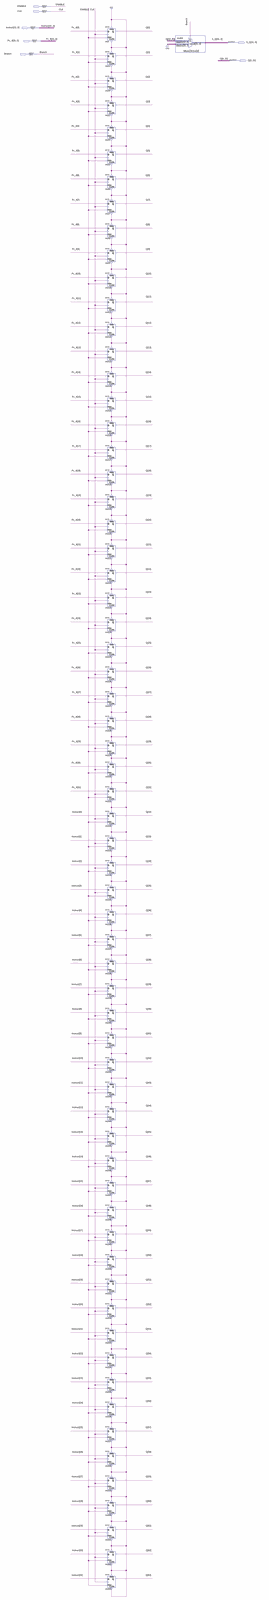
[diagram p0: schematic sheet, whole]
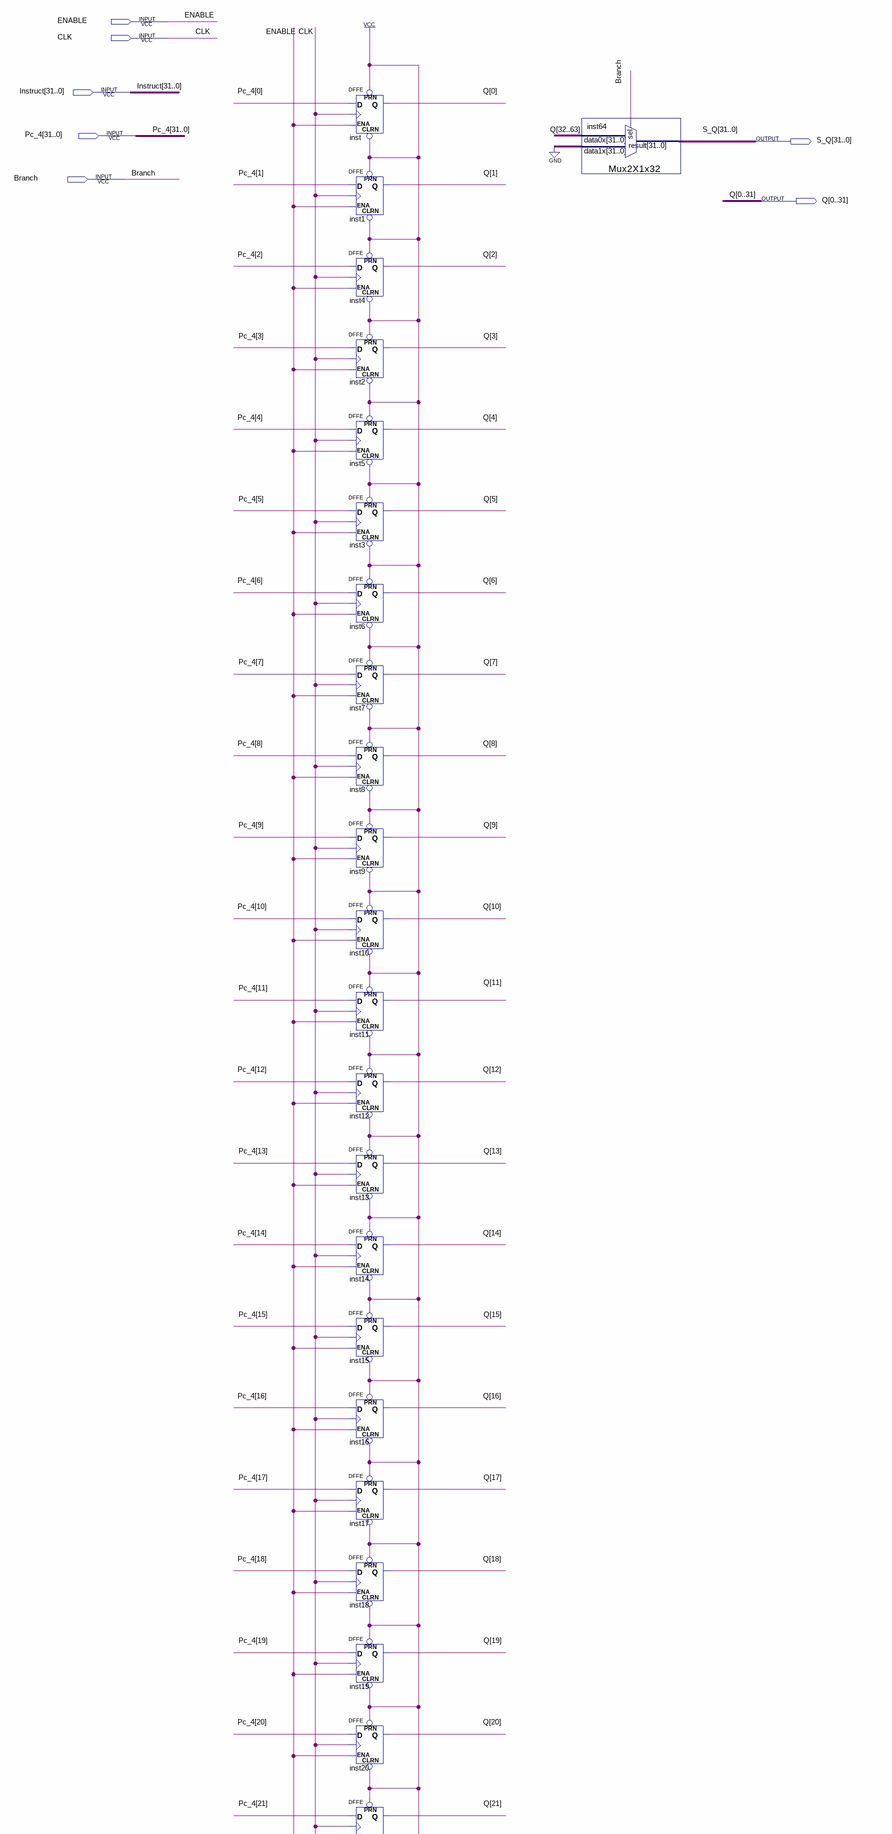
[diagram p1: schematic sheet, upper part]
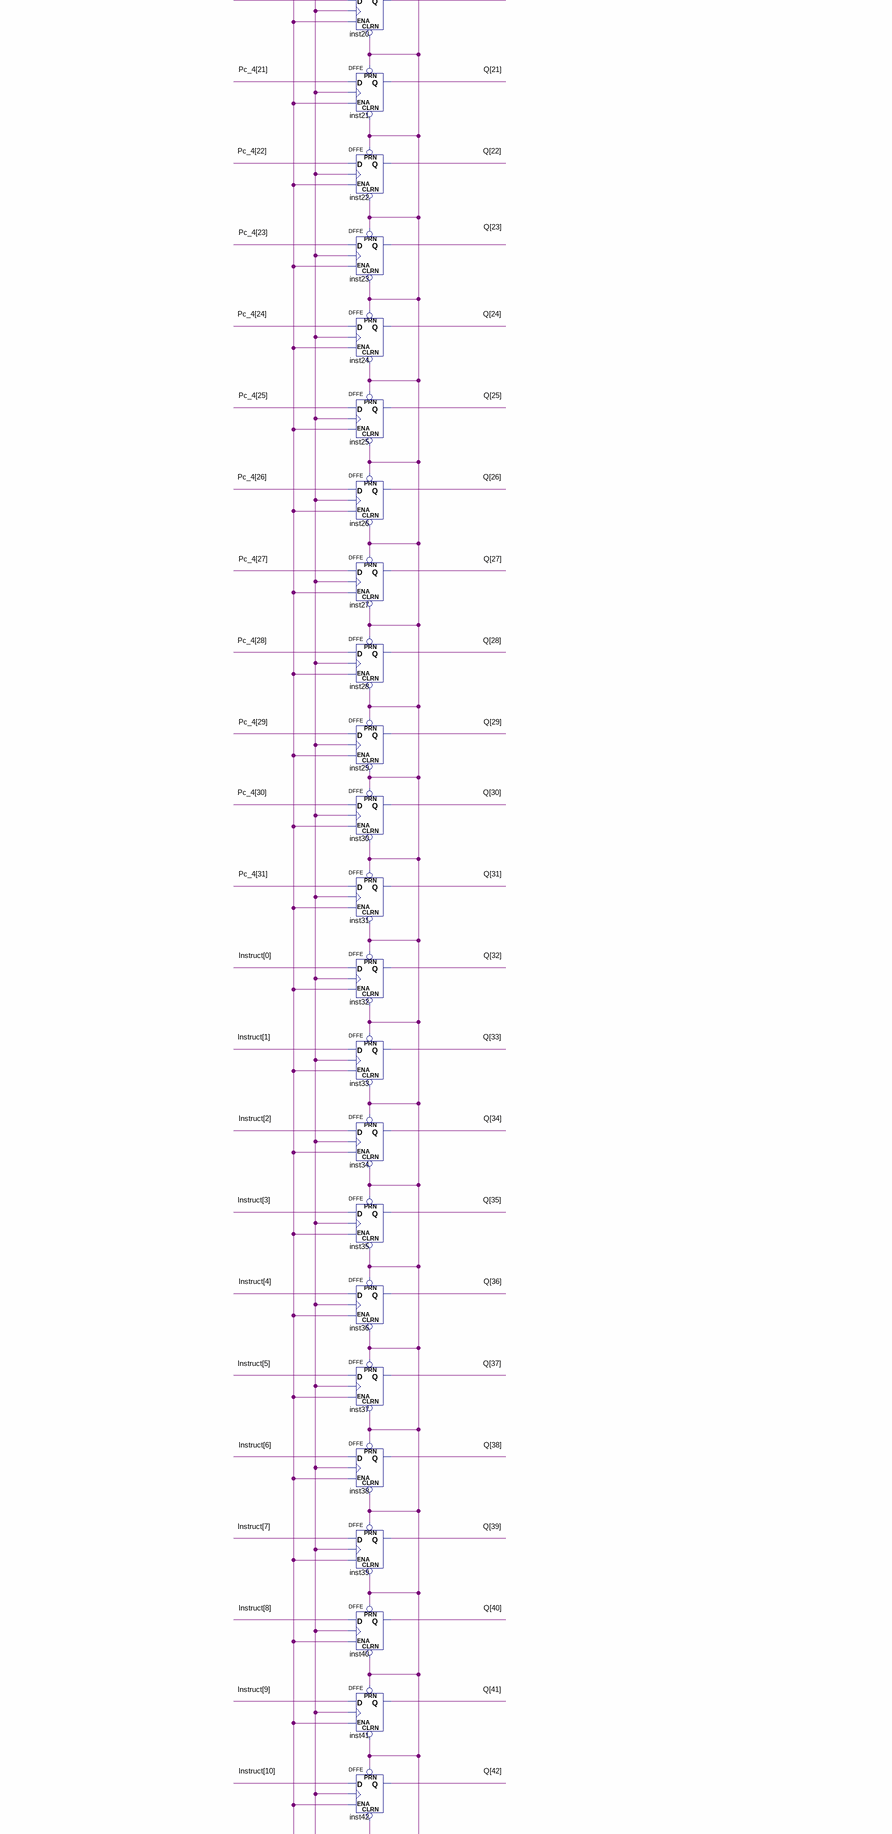
[diagram p2: schematic sheet, middle part]
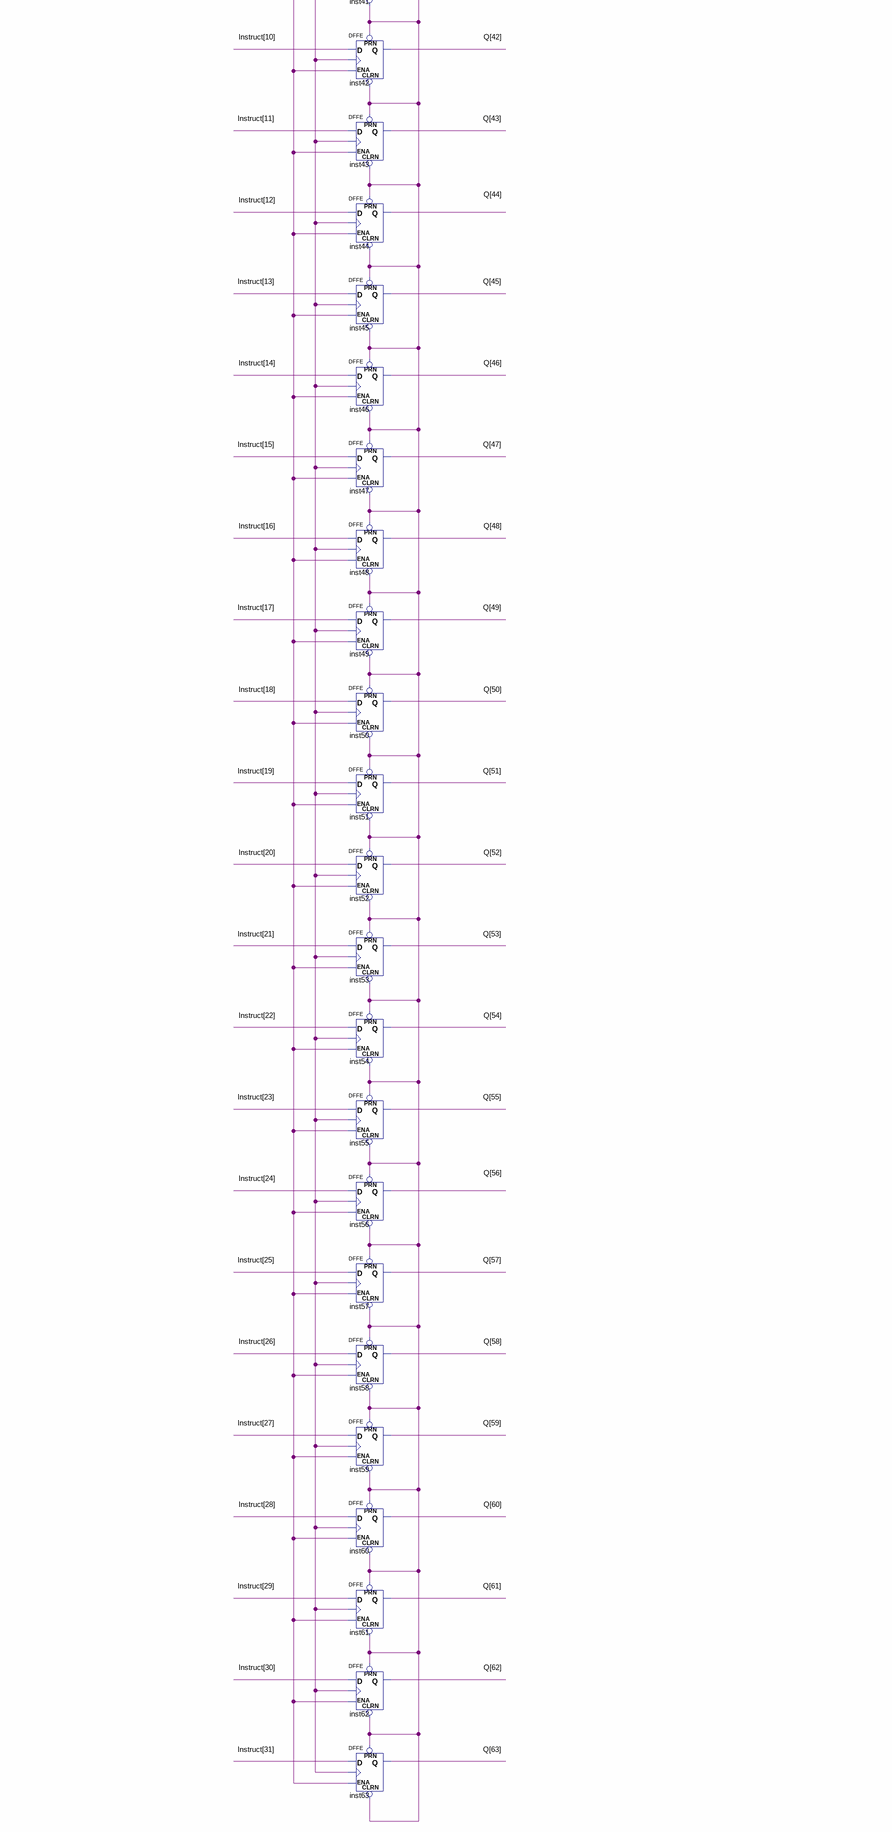
[diagram p3: schematic sheet, lower part]
// Quartus schematic Reg64_Bits.bdf as structural Verilog: 65 symbols, 7 pins
module Reg64_Bits (
  input  ENABLE,
  input  CLK,
  input  [31:0] Instruct,
  input  [31:0] Pc_4,
  input  Branch,
  output [31:0] S_Q,
  output [0:63] Q
);

  DFFE inst (.PRN(1'b1), .CLRN(1'b1), .D(Pc_4[0]), .CLK(CLK), .ENA(ENABLE), .Q(Q[0]));
  DFFE inst1 (.PRN(1'b1), .CLRN(1'b1), .D(Pc_4[1]), .CLK(CLK), .ENA(ENABLE), .Q(Q[1]));
  DFFE inst4 (.PRN(1'b1), .CLRN(1'b1), .D(Pc_4[2]), .CLK(CLK), .ENA(ENABLE), .Q(Q[2]));
  DFFE inst2 (.PRN(1'b1), .CLRN(1'b1), .D(Pc_4[3]), .CLK(CLK), .ENA(ENABLE), .Q(Q[3]));
  DFFE inst5 (.PRN(1'b1), .CLRN(1'b1), .D(Pc_4[4]), .CLK(CLK), .ENA(ENABLE), .Q(Q[4]));
  DFFE inst3 (.PRN(1'b1), .CLRN(1'b1), .D(Pc_4[5]), .CLK(CLK), .ENA(ENABLE), .Q(Q[5]));
  DFFE inst6 (.PRN(1'b1), .CLRN(1'b1), .D(Pc_4[6]), .CLK(CLK), .ENA(ENABLE), .Q(Q[6]));
  DFFE inst7 (.PRN(1'b1), .CLRN(1'b1), .D(Pc_4[7]), .CLK(CLK), .ENA(ENABLE), .Q(Q[7]));
  DFFE inst8 (.PRN(1'b1), .CLRN(1'b1), .D(Pc_4[8]), .CLK(CLK), .ENA(ENABLE), .Q(Q[8]));
  DFFE inst9 (.PRN(1'b1), .CLRN(1'b1), .D(Pc_4[9]), .CLK(CLK), .ENA(ENABLE), .Q(Q[9]));
  DFFE inst10 (.PRN(1'b1), .CLRN(1'b1), .D(Pc_4[10]), .CLK(CLK), .ENA(ENABLE), .Q(Q[10]));
  DFFE inst11 (.PRN(1'b1), .CLRN(1'b1), .D(Pc_4[11]), .CLK(CLK), .ENA(ENABLE), .Q(Q[11]));
  DFFE inst12 (.PRN(1'b1), .CLRN(1'b1), .D(Pc_4[12]), .CLK(CLK), .ENA(ENABLE), .Q(Q[12]));
  DFFE inst13 (.PRN(1'b1), .CLRN(1'b1), .D(Pc_4[13]), .CLK(CLK), .ENA(ENABLE), .Q(Q[13]));
  DFFE inst14 (.PRN(1'b1), .CLRN(1'b1), .D(Pc_4[14]), .CLK(CLK), .ENA(ENABLE), .Q(Q[14]));
  DFFE inst15 (.PRN(1'b1), .CLRN(1'b1), .D(Pc_4[15]), .CLK(CLK), .ENA(ENABLE), .Q(Q[15]));
  DFFE inst16 (.PRN(1'b1), .CLRN(1'b1), .D(Pc_4[16]), .CLK(CLK), .ENA(ENABLE), .Q(Q[16]));
  DFFE inst17 (.PRN(1'b1), .CLRN(1'b1), .D(Pc_4[17]), .CLK(CLK), .ENA(ENABLE), .Q(Q[17]));
  DFFE inst18 (.PRN(1'b1), .CLRN(1'b1), .D(Pc_4[18]), .CLK(CLK), .ENA(ENABLE), .Q(Q[18]));
  DFFE inst19 (.PRN(1'b1), .CLRN(1'b1), .D(Pc_4[19]), .CLK(CLK), .ENA(ENABLE), .Q(Q[19]));
  DFFE inst20 (.PRN(1'b1), .CLRN(1'b1), .D(Pc_4[20]), .CLK(CLK), .ENA(ENABLE), .Q(Q[20]));
  DFFE inst21 (.PRN(1'b1), .CLRN(1'b1), .D(Pc_4[21]), .CLK(CLK), .ENA(ENABLE), .Q(Q[21]));
  DFFE inst22 (.PRN(1'b1), .CLRN(1'b1), .D(Pc_4[22]), .CLK(CLK), .ENA(ENABLE), .Q(Q[22]));
  DFFE inst23 (.PRN(1'b1), .CLRN(1'b1), .D(Pc_4[23]), .CLK(CLK), .ENA(ENABLE), .Q(Q[23]));
  DFFE inst24 (.PRN(1'b1), .CLRN(1'b1), .D(Pc_4[24]), .CLK(CLK), .ENA(ENABLE), .Q(Q[24]));
  DFFE inst25 (.PRN(1'b1), .CLRN(1'b1), .D(Pc_4[25]), .CLK(CLK), .ENA(ENABLE), .Q(Q[25]));
  DFFE inst26 (.PRN(1'b1), .CLRN(1'b1), .D(Pc_4[26]), .CLK(CLK), .ENA(ENABLE), .Q(Q[26]));
  DFFE inst27 (.PRN(1'b1), .CLRN(1'b1), .D(Pc_4[27]), .CLK(CLK), .ENA(ENABLE), .Q(Q[27]));
  DFFE inst28 (.PRN(1'b1), .CLRN(1'b1), .D(Pc_4[28]), .CLK(CLK), .ENA(ENABLE), .Q(Q[28]));
  DFFE inst29 (.PRN(1'b1), .CLRN(1'b1), .D(Pc_4[29]), .CLK(CLK), .ENA(ENABLE), .Q(Q[29]));
  DFFE inst30 (.PRN(1'b1), .CLRN(1'b1), .D(Pc_4[30]), .CLK(CLK), .ENA(ENABLE), .Q(Q[30]));
  DFFE inst31 (.PRN(1'b1), .CLRN(1'b1), .D(Pc_4[31]), .CLK(CLK), .ENA(ENABLE), .Q(Q[31]));
  DFFE inst32 (.PRN(1'b1), .CLRN(1'b1), .D(Instruct[0]), .CLK(CLK), .ENA(ENABLE), .Q(Q[32]));
  DFFE inst33 (.PRN(1'b1), .CLRN(1'b1), .D(Instruct[1]), .CLK(CLK), .ENA(ENABLE), .Q(Q[33]));
  DFFE inst34 (.PRN(1'b1), .CLRN(1'b1), .D(Instruct[2]), .CLK(CLK), .ENA(ENABLE), .Q(Q[34]));
  DFFE inst35 (.PRN(1'b1), .CLRN(1'b1), .D(Instruct[3]), .CLK(CLK), .ENA(ENABLE), .Q(Q[35]));
  DFFE inst36 (.PRN(1'b1), .CLRN(1'b1), .D(Instruct[4]), .CLK(CLK), .ENA(ENABLE), .Q(Q[36]));
  DFFE inst37 (.PRN(1'b1), .CLRN(1'b1), .D(Instruct[5]), .CLK(CLK), .ENA(ENABLE), .Q(Q[37]));
  DFFE inst38 (.PRN(1'b1), .CLRN(1'b1), .D(Instruct[6]), .CLK(CLK), .ENA(ENABLE), .Q(Q[38]));
  DFFE inst39 (.PRN(1'b1), .CLRN(1'b1), .D(Instruct[7]), .CLK(CLK), .ENA(ENABLE), .Q(Q[39]));
  DFFE inst40 (.PRN(1'b1), .CLRN(1'b1), .D(Instruct[8]), .CLK(CLK), .ENA(ENABLE), .Q(Q[40]));
  DFFE inst41 (.PRN(1'b1), .CLRN(1'b1), .D(Instruct[9]), .CLK(CLK), .ENA(ENABLE), .Q(Q[41]));
  DFFE inst42 (.PRN(1'b1), .CLRN(1'b1), .D(Instruct[10]), .CLK(CLK), .ENA(ENABLE), .Q(Q[42]));
  DFFE inst43 (.PRN(1'b1), .CLRN(1'b1), .D(Instruct[11]), .CLK(CLK), .ENA(ENABLE), .Q(Q[43]));
  DFFE inst44 (.PRN(1'b1), .CLRN(1'b1), .D(Instruct[12]), .CLK(CLK), .ENA(ENABLE), .Q(Q[44]));
  DFFE inst45 (.PRN(1'b1), .CLRN(1'b1), .D(Instruct[13]), .CLK(CLK), .ENA(ENABLE), .Q(Q[45]));
  DFFE inst46 (.PRN(1'b1), .CLRN(1'b1), .D(Instruct[14]), .CLK(CLK), .ENA(ENABLE), .Q(Q[46]));
  DFFE inst47 (.PRN(1'b1), .CLRN(1'b1), .D(Instruct[15]), .CLK(CLK), .ENA(ENABLE), .Q(Q[47]));
  DFFE inst48 (.PRN(1'b1), .CLRN(1'b1), .D(Instruct[16]), .CLK(CLK), .ENA(ENABLE), .Q(Q[48]));
  DFFE inst49 (.PRN(1'b1), .CLRN(1'b1), .D(Instruct[17]), .CLK(CLK), .ENA(ENABLE), .Q(Q[49]));
  DFFE inst50 (.PRN(1'b1), .CLRN(1'b1), .D(Instruct[18]), .CLK(CLK), .ENA(ENABLE), .Q(Q[50]));
  DFFE inst51 (.PRN(1'b1), .CLRN(1'b1), .D(Instruct[19]), .CLK(CLK), .ENA(ENABLE), .Q(Q[51]));
  DFFE inst52 (.PRN(1'b1), .CLRN(1'b1), .D(Instruct[20]), .CLK(CLK), .ENA(ENABLE), .Q(Q[52]));
  DFFE inst53 (.PRN(1'b1), .CLRN(1'b1), .D(Instruct[21]), .CLK(CLK), .ENA(ENABLE), .Q(Q[53]));
  DFFE inst54 (.PRN(1'b1), .CLRN(1'b1), .D(Instruct[22]), .CLK(CLK), .ENA(ENABLE), .Q(Q[54]));
  DFFE inst55 (.PRN(1'b1), .CLRN(1'b1), .D(Instruct[23]), .CLK(CLK), .ENA(ENABLE), .Q(Q[55]));
  DFFE inst56 (.PRN(1'b1), .CLRN(1'b1), .D(Instruct[24]), .CLK(CLK), .ENA(ENABLE), .Q(Q[56]));
  DFFE inst57 (.PRN(1'b1), .CLRN(1'b1), .D(Instruct[25]), .CLK(CLK), .ENA(ENABLE), .Q(Q[57]));
  DFFE inst58 (.PRN(1'b1), .CLRN(1'b1), .D(Instruct[26]), .CLK(CLK), .ENA(ENABLE), .Q(Q[58]));
  DFFE inst59 (.PRN(1'b1), .CLRN(1'b1), .D(Instruct[27]), .CLK(CLK), .ENA(ENABLE), .Q(Q[59]));
  DFFE inst60 (.PRN(1'b1), .CLRN(1'b1), .D(Instruct[28]), .CLK(CLK), .ENA(ENABLE), .Q(Q[60]));
  DFFE inst61 (.PRN(1'b1), .CLRN(1'b1), .D(Instruct[29]), .CLK(CLK), .ENA(ENABLE), .Q(Q[61]));
  DFFE inst62 (.PRN(1'b1), .CLRN(1'b1), .D(Instruct[30]), .CLK(CLK), .ENA(ENABLE), .Q(Q[62]));
  DFFE inst63 (.PRN(1'b1), .CLRN(1'b1), .D(Instruct[31]), .CLK(CLK), .ENA(ENABLE), .Q(Q[63]));
  Mux2X1x32 inst64 (.data1x({32{1'b0}}), .data0x(Q[32:63]), .sel(Branch), .result(S_Q));
endmodule
